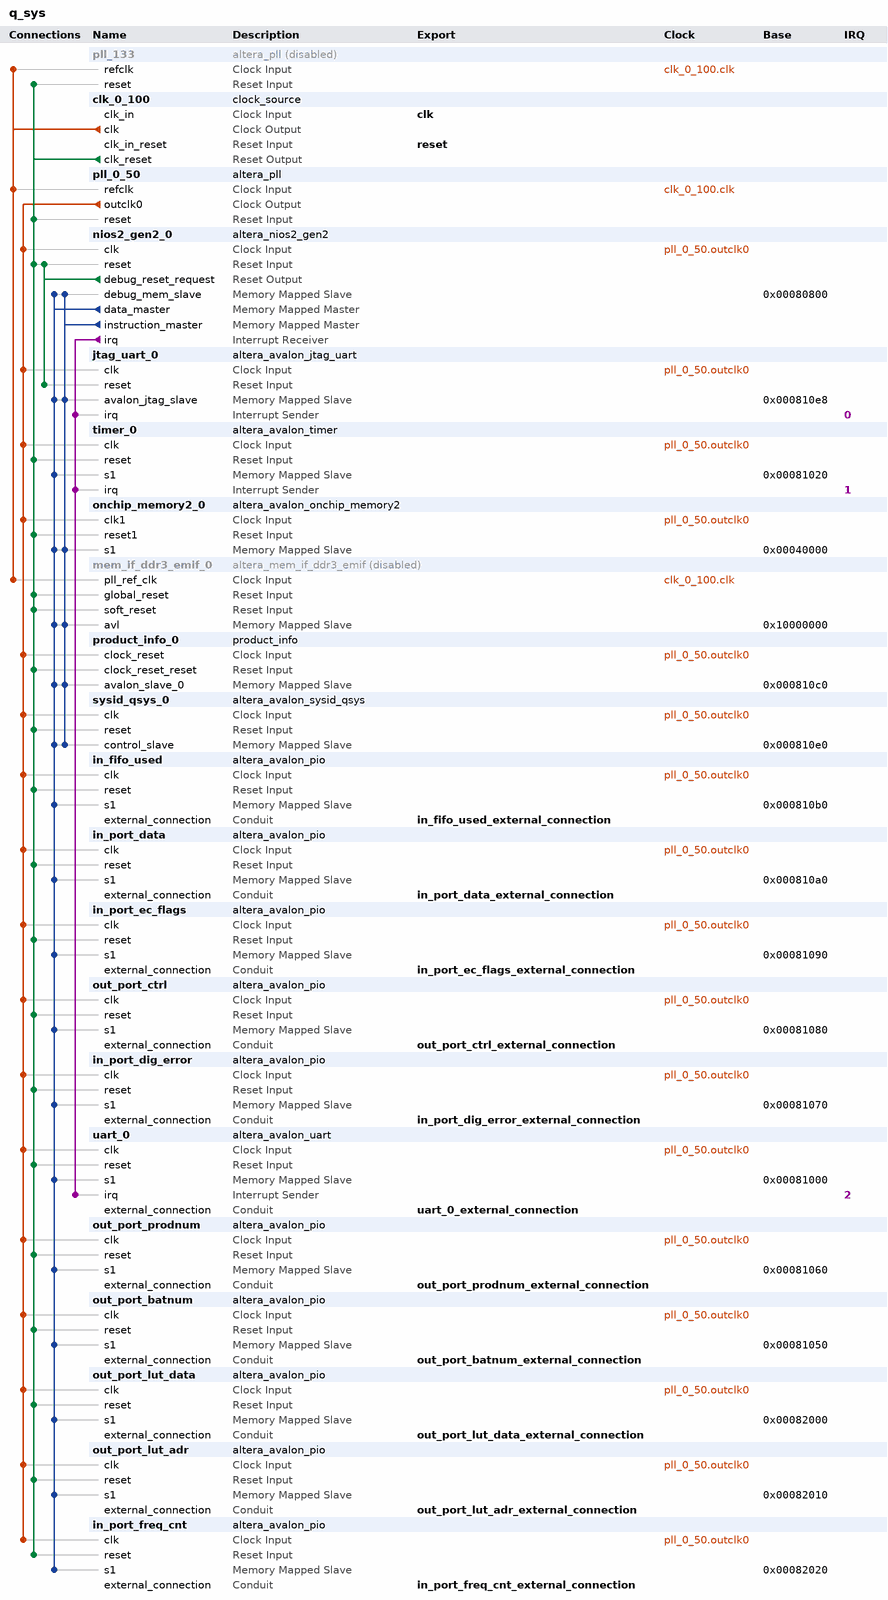
[diagram p0: system contents]
# Platform Designer (Qsys) system q_sys, Arria V 5AGXFB3H4F35C5
# Parameters at their usual value, and those the tool derives, are not listed.
package require -exact qsys 18.1
create_system q_sys
set_project_property DEVICE_FAMILY {Arria V}
set_project_property DEVICE 5AGXFB3H4F35C5

add_instance pll_133 altera_pll 18.1
set_instance_property pll_133 ENABLED false
set_instance_parameter_value pll_133 gui_device_speed_grade 1
set_instance_parameter_value pll_133 gui_number_of_clocks 1
set_instance_parameter_value pll_133 gui_operation_mode direct
set_instance_parameter_value pll_133 gui_output_clock_frequency0 133.0
set_instance_parameter_value pll_133 gui_pll_mode {Integer-N PLL}
set_instance_parameter_value pll_133 gui_reference_clock_frequency 100.0
set_instance_parameter_value pll_133 gui_use_locked true

add_instance clk_0_100 clock_source 18.1
set_instance_parameter_value clk_0_100 clockFrequency 100000000

add_instance pll_0_50 altera_pll 18.1
set_instance_parameter_value pll_0_50 gui_device_speed_grade 2
set_instance_parameter_value pll_0_50 gui_fractional_cout 24
set_instance_parameter_value pll_0_50 gui_number_of_clocks 1
set_instance_parameter_value pll_0_50 gui_operation_mode direct
set_instance_parameter_value pll_0_50 gui_output_clock_frequency0 50.0
set_instance_parameter_value pll_0_50 gui_pll_mode {Fractional-N PLL}
set_instance_parameter_value pll_0_50 gui_reference_clock_frequency 100.0
set_instance_parameter_value pll_0_50 gui_use_locked false

add_instance nios2_gen2_0 altera_nios2_gen2 18.1
set_instance_parameter_value nios2_gen2_0 dcache_size 2048
set_instance_parameter_value nios2_gen2_0 exceptionSlave onchip_memory2_0.s1
set_instance_parameter_value nios2_gen2_0 icache_size 4096
set_instance_parameter_value nios2_gen2_0 impl Tiny
set_instance_parameter_value nios2_gen2_0 resetSlave onchip_memory2_0.s1

add_instance jtag_uart_0 altera_avalon_jtag_uart 18.1
set_instance_parameter_value jtag_uart_0 simInteractiveOptions NO_INTERACTIVE_WINDOWS

add_instance timer_0 altera_avalon_timer 18.1
set_instance_parameter_value timer_0 period 1
set_instance_parameter_value timer_0 periodUnits MSEC

add_instance onchip_memory2_0 altera_avalon_onchip_memory2 18.1
set_instance_parameter_value onchip_memory2_0 allowInSystemMemoryContentEditor true
set_instance_parameter_value onchip_memory2_0 dataWidth 32
set_instance_parameter_value onchip_memory2_0 dualPort false
set_instance_parameter_value onchip_memory2_0 initMemContent false
set_instance_parameter_value onchip_memory2_0 initializationFileName onchip_mem.hex
set_instance_parameter_value onchip_memory2_0 instanceID CPU1
set_instance_parameter_value onchip_memory2_0 memorySize 196608
set_instance_parameter_value onchip_memory2_0 slave1Latency 2

add_instance mem_if_ddr3_emif_0 altera_mem_if_ddr3_emif 18.1
set_instance_property mem_if_ddr3_emif_0 ENABLED false
set_instance_parameter_value mem_if_ddr3_emif_0 AVL_DATA_WIDTH_PORT 128,32,32,32,32,32
set_instance_parameter_value mem_if_ddr3_emif_0 AVL_MAX_SIZE 64
set_instance_parameter_value mem_if_ddr3_emif_0 CALIBRATION_MODE Skip
set_instance_parameter_value mem_if_ddr3_emif_0 CPORT_TYPE_PORT Bidirectional,Bidirectional,Bidirectional,Bidirectional,Bidirectional,Bidirectional
set_instance_parameter_value mem_if_ddr3_emif_0 EXPORT_AFI_HALF_CLK false
set_instance_parameter_value mem_if_ddr3_emif_0 HARD_EMIF false
set_instance_parameter_value mem_if_ddr3_emif_0 MEM_BANKADDR_WIDTH 3
set_instance_parameter_value mem_if_ddr3_emif_0 MEM_CLK_FREQ 400.0
set_instance_parameter_value mem_if_ddr3_emif_0 MEM_CLK_FREQ_MAX 400.0
set_instance_parameter_value mem_if_ddr3_emif_0 MEM_COL_ADDR_WIDTH 10
set_instance_parameter_value mem_if_ddr3_emif_0 MEM_DQ_WIDTH 32
set_instance_parameter_value mem_if_ddr3_emif_0 MEM_DRV_STR RZQ/6
set_instance_parameter_value mem_if_ddr3_emif_0 MEM_FORMAT DISCRETE
set_instance_parameter_value mem_if_ddr3_emif_0 MEM_ROW_ADDR_WIDTH 13
set_instance_parameter_value mem_if_ddr3_emif_0 MEM_RTT_NOM RZQ/4
set_instance_parameter_value mem_if_ddr3_emif_0 MEM_TCL 9
set_instance_parameter_value mem_if_ddr3_emif_0 MEM_TFAW_NS 45.0
set_instance_parameter_value mem_if_ddr3_emif_0 MEM_TRAS_NS 36.0
set_instance_parameter_value mem_if_ddr3_emif_0 MEM_TRCD_NS 13.5
set_instance_parameter_value mem_if_ddr3_emif_0 MEM_TRFC_NS 110.0
set_instance_parameter_value mem_if_ddr3_emif_0 MEM_TRP_NS 13.5
set_instance_parameter_value mem_if_ddr3_emif_0 MEM_TRRD_NS 7.5
set_instance_parameter_value mem_if_ddr3_emif_0 MEM_TRTP_NS 7.5
set_instance_parameter_value mem_if_ddr3_emif_0 MEM_TWTR 5
set_instance_parameter_value mem_if_ddr3_emif_0 MEM_VENDOR Micron
set_instance_parameter_value mem_if_ddr3_emif_0 MEM_WTCL 7
set_instance_parameter_value mem_if_ddr3_emif_0 PLL_LOCATION Top_Bottom
set_instance_parameter_value mem_if_ddr3_emif_0 POWER_OF_TWO_BUS true
set_instance_parameter_value mem_if_ddr3_emif_0 PRIORITY_PORT 1,1,1,1,1,1
set_instance_parameter_value mem_if_ddr3_emif_0 RATE Quarter
set_instance_parameter_value mem_if_ddr3_emif_0 REF_CLK_FREQ 100.0
set_instance_parameter_value mem_if_ddr3_emif_0 SPEED_GRADE 4
set_instance_parameter_value mem_if_ddr3_emif_0 TIMING_BOARD_AC_SKEW 0.0039
set_instance_parameter_value mem_if_ddr3_emif_0 TIMING_BOARD_AC_TO_CK_SKEW -0.001
set_instance_parameter_value mem_if_ddr3_emif_0 TIMING_BOARD_DERATE_METHOD SLEW_RATE
set_instance_parameter_value mem_if_ddr3_emif_0 TIMING_BOARD_DQ_TO_DQS_SKEW -0.004
set_instance_parameter_value mem_if_ddr3_emif_0 TIMING_BOARD_MAX_CK_DELAY 0.42
set_instance_parameter_value mem_if_ddr3_emif_0 TIMING_BOARD_MAX_DQS_DELAY 0.437
set_instance_parameter_value mem_if_ddr3_emif_0 TIMING_BOARD_SKEW_BETWEEN_DQS 0.029
set_instance_parameter_value mem_if_ddr3_emif_0 TIMING_BOARD_SKEW_CKDQS_DIMM_MAX 0.012
set_instance_parameter_value mem_if_ddr3_emif_0 TIMING_BOARD_SKEW_CKDQS_DIMM_MIN -0.0039
set_instance_parameter_value mem_if_ddr3_emif_0 TIMING_BOARD_SKEW_WITHIN_DQS 0.011
set_instance_parameter_value mem_if_ddr3_emif_0 TIMING_TDH 65
set_instance_parameter_value mem_if_ddr3_emif_0 TIMING_TDQSCK 255
set_instance_parameter_value mem_if_ddr3_emif_0 TIMING_TDQSQ 125
set_instance_parameter_value mem_if_ddr3_emif_0 TIMING_TDQSS 0.25
set_instance_parameter_value mem_if_ddr3_emif_0 TIMING_TDS 30
set_instance_parameter_value mem_if_ddr3_emif_0 TIMING_TDSH 0.2
set_instance_parameter_value mem_if_ddr3_emif_0 TIMING_TDSS 0.2
set_instance_parameter_value mem_if_ddr3_emif_0 TIMING_TIH 140
set_instance_parameter_value mem_if_ddr3_emif_0 TIMING_TIS 190
set_instance_parameter_value mem_if_ddr3_emif_0 TIMING_TQSH 0.4
set_instance_parameter_value mem_if_ddr3_emif_0 USER_DEBUG_LEVEL 1

add_instance product_info_0 product_info 1.0

add_instance sysid_qsys_0 altera_avalon_sysid_qsys 18.1
set_instance_parameter_value sysid_qsys_0 id 1

add_instance in_fifo_used altera_avalon_pio 18.1
set_instance_parameter_value in_fifo_used direction Input
set_instance_parameter_value in_fifo_used width 10

add_instance in_port_data altera_avalon_pio 18.1
set_instance_parameter_value in_port_data direction Input
set_instance_parameter_value in_port_data width 32

add_instance in_port_ec_flags altera_avalon_pio 18.1
set_instance_parameter_value in_port_ec_flags direction Input
set_instance_parameter_value in_port_ec_flags width 3

add_instance out_port_ctrl altera_avalon_pio 18.1
set_instance_parameter_value out_port_ctrl direction Output
set_instance_parameter_value out_port_ctrl width 8

add_instance in_port_dig_error altera_avalon_pio 18.1
set_instance_parameter_value in_port_dig_error direction Input
set_instance_parameter_value in_port_dig_error width 20

add_instance uart_0 altera_avalon_uart 18.1
set_instance_parameter_value uart_0 baud 115200
set_instance_parameter_value uart_0 dataBits 8
set_instance_parameter_value uart_0 fixedBaud true
set_instance_parameter_value uart_0 parity NONE
set_instance_parameter_value uart_0 stopBits 1

add_instance out_port_prodnum altera_avalon_pio 18.1
set_instance_parameter_value out_port_prodnum direction Output
set_instance_parameter_value out_port_prodnum width 10

add_instance out_port_batnum altera_avalon_pio 18.1
set_instance_parameter_value out_port_batnum direction Output
set_instance_parameter_value out_port_batnum width 10

add_instance out_port_lut_data altera_avalon_pio 18.1
set_instance_parameter_value out_port_lut_data direction Output
set_instance_parameter_value out_port_lut_data width 32

add_instance out_port_lut_adr altera_avalon_pio 18.1
set_instance_parameter_value out_port_lut_adr direction Output
set_instance_parameter_value out_port_lut_adr width 11

add_instance in_port_freq_cnt altera_avalon_pio 18.1
set_instance_parameter_value in_port_freq_cnt direction Input
set_instance_parameter_value in_port_freq_cnt width 16

# connections
add_connection clk_0_100.clk mem_if_ddr3_emif_0.pll_ref_clk clock
add_connection clk_0_100.clk pll_0_50.refclk clock
add_connection clk_0_100.clk pll_133.refclk clock
add_connection pll_0_50.outclk0 in_fifo_used.clk clock
add_connection pll_0_50.outclk0 in_port_data.clk clock
add_connection pll_0_50.outclk0 in_port_dig_error.clk clock
add_connection pll_0_50.outclk0 in_port_ec_flags.clk clock
add_connection pll_0_50.outclk0 in_port_freq_cnt.clk clock
add_connection pll_0_50.outclk0 jtag_uart_0.clk clock
add_connection pll_0_50.outclk0 nios2_gen2_0.clk clock
add_connection pll_0_50.outclk0 onchip_memory2_0.clk1 clock
add_connection pll_0_50.outclk0 out_port_batnum.clk clock
add_connection pll_0_50.outclk0 out_port_ctrl.clk clock
add_connection pll_0_50.outclk0 out_port_lut_adr.clk clock
add_connection pll_0_50.outclk0 out_port_lut_data.clk clock
add_connection pll_0_50.outclk0 out_port_prodnum.clk clock
add_connection pll_0_50.outclk0 product_info_0.clock_reset clock
add_connection pll_0_50.outclk0 sysid_qsys_0.clk clock
add_connection pll_0_50.outclk0 timer_0.clk clock
add_connection pll_0_50.outclk0 uart_0.clk clock
add_connection clk_0_100.clk_reset in_fifo_used.reset reset
add_connection clk_0_100.clk_reset in_port_data.reset reset
add_connection clk_0_100.clk_reset in_port_dig_error.reset reset
add_connection clk_0_100.clk_reset in_port_ec_flags.reset reset
add_connection clk_0_100.clk_reset in_port_freq_cnt.reset reset
add_connection clk_0_100.clk_reset mem_if_ddr3_emif_0.global_reset reset
add_connection clk_0_100.clk_reset mem_if_ddr3_emif_0.soft_reset reset
add_connection clk_0_100.clk_reset nios2_gen2_0.reset reset
add_connection clk_0_100.clk_reset onchip_memory2_0.reset1 reset
add_connection clk_0_100.clk_reset out_port_batnum.reset reset
add_connection clk_0_100.clk_reset out_port_ctrl.reset reset
add_connection clk_0_100.clk_reset out_port_lut_adr.reset reset
add_connection clk_0_100.clk_reset out_port_lut_data.reset reset
add_connection clk_0_100.clk_reset out_port_prodnum.reset reset
add_connection clk_0_100.clk_reset pll_0_50.reset reset
add_connection clk_0_100.clk_reset pll_133.reset reset
add_connection clk_0_100.clk_reset product_info_0.clock_reset_reset reset
add_connection clk_0_100.clk_reset sysid_qsys_0.reset reset
add_connection clk_0_100.clk_reset timer_0.reset reset
add_connection clk_0_100.clk_reset uart_0.reset reset
add_connection nios2_gen2_0.debug_reset_request jtag_uart_0.reset reset
add_connection nios2_gen2_0.debug_reset_request nios2_gen2_0.reset reset
add_connection nios2_gen2_0.data_master in_fifo_used.s1 avalon
set_connection_parameter_value nios2_gen2_0.data_master/in_fifo_used.s1 baseAddress 0x000810b0
add_connection nios2_gen2_0.data_master in_port_data.s1 avalon
set_connection_parameter_value nios2_gen2_0.data_master/in_port_data.s1 baseAddress 0x000810a0
add_connection nios2_gen2_0.data_master in_port_dig_error.s1 avalon
set_connection_parameter_value nios2_gen2_0.data_master/in_port_dig_error.s1 baseAddress 0x00081070
add_connection nios2_gen2_0.data_master in_port_ec_flags.s1 avalon
set_connection_parameter_value nios2_gen2_0.data_master/in_port_ec_flags.s1 baseAddress 0x00081090
add_connection nios2_gen2_0.data_master in_port_freq_cnt.s1 avalon
set_connection_parameter_value nios2_gen2_0.data_master/in_port_freq_cnt.s1 baseAddress 0x00082020
add_connection nios2_gen2_0.data_master jtag_uart_0.avalon_jtag_slave avalon
set_connection_parameter_value nios2_gen2_0.data_master/jtag_uart_0.avalon_jtag_slave baseAddress 0x000810e8
add_connection nios2_gen2_0.data_master mem_if_ddr3_emif_0.avl avalon
set_connection_parameter_value nios2_gen2_0.data_master/mem_if_ddr3_emif_0.avl baseAddress 0x10000000
add_connection nios2_gen2_0.data_master nios2_gen2_0.debug_mem_slave avalon
set_connection_parameter_value nios2_gen2_0.data_master/nios2_gen2_0.debug_mem_slave baseAddress 0x00080800
add_connection nios2_gen2_0.data_master onchip_memory2_0.s1 avalon
set_connection_parameter_value nios2_gen2_0.data_master/onchip_memory2_0.s1 baseAddress 0x00040000
add_connection nios2_gen2_0.data_master out_port_batnum.s1 avalon
set_connection_parameter_value nios2_gen2_0.data_master/out_port_batnum.s1 baseAddress 0x00081050
add_connection nios2_gen2_0.data_master out_port_ctrl.s1 avalon
set_connection_parameter_value nios2_gen2_0.data_master/out_port_ctrl.s1 baseAddress 0x00081080
add_connection nios2_gen2_0.data_master out_port_lut_adr.s1 avalon
set_connection_parameter_value nios2_gen2_0.data_master/out_port_lut_adr.s1 baseAddress 0x00082010
add_connection nios2_gen2_0.data_master out_port_lut_data.s1 avalon
set_connection_parameter_value nios2_gen2_0.data_master/out_port_lut_data.s1 baseAddress 0x00082000
add_connection nios2_gen2_0.data_master out_port_prodnum.s1 avalon
set_connection_parameter_value nios2_gen2_0.data_master/out_port_prodnum.s1 baseAddress 0x00081060
add_connection nios2_gen2_0.data_master product_info_0.avalon_slave_0 avalon
set_connection_parameter_value nios2_gen2_0.data_master/product_info_0.avalon_slave_0 baseAddress 0x000810c0
add_connection nios2_gen2_0.data_master sysid_qsys_0.control_slave avalon
set_connection_parameter_value nios2_gen2_0.data_master/sysid_qsys_0.control_slave baseAddress 0x000810e0
add_connection nios2_gen2_0.data_master timer_0.s1 avalon
set_connection_parameter_value nios2_gen2_0.data_master/timer_0.s1 baseAddress 0x00081020
add_connection nios2_gen2_0.data_master uart_0.s1 avalon
set_connection_parameter_value nios2_gen2_0.data_master/uart_0.s1 baseAddress 0x00081000
add_connection nios2_gen2_0.instruction_master jtag_uart_0.avalon_jtag_slave avalon
set_connection_parameter_value nios2_gen2_0.instruction_master/jtag_uart_0.avalon_jtag_slave baseAddress 0x000810e8
add_connection nios2_gen2_0.instruction_master mem_if_ddr3_emif_0.avl avalon
set_connection_parameter_value nios2_gen2_0.instruction_master/mem_if_ddr3_emif_0.avl baseAddress 0x10000000
add_connection nios2_gen2_0.instruction_master nios2_gen2_0.debug_mem_slave avalon
set_connection_parameter_value nios2_gen2_0.instruction_master/nios2_gen2_0.debug_mem_slave baseAddress 0x00080800
add_connection nios2_gen2_0.instruction_master onchip_memory2_0.s1 avalon
set_connection_parameter_value nios2_gen2_0.instruction_master/onchip_memory2_0.s1 baseAddress 0x00040000
add_connection nios2_gen2_0.instruction_master product_info_0.avalon_slave_0 avalon
set_connection_parameter_value nios2_gen2_0.instruction_master/product_info_0.avalon_slave_0 baseAddress 0x000810c0
add_connection nios2_gen2_0.instruction_master sysid_qsys_0.control_slave avalon
set_connection_parameter_value nios2_gen2_0.instruction_master/sysid_qsys_0.control_slave baseAddress 0x000810e0
add_connection nios2_gen2_0.irq jtag_uart_0.irq interrupt
set_connection_parameter_value nios2_gen2_0.irq/jtag_uart_0.irq irqNumber 0
add_connection nios2_gen2_0.irq timer_0.irq interrupt
set_connection_parameter_value nios2_gen2_0.irq/timer_0.irq irqNumber 1
add_connection nios2_gen2_0.irq uart_0.irq interrupt
set_connection_parameter_value nios2_gen2_0.irq/uart_0.irq irqNumber 2

# exported interfaces
add_interface clk clock sink
set_interface_property clk EXPORT_OF clk_0_100.clk_in
add_interface in_fifo_used_external_connection conduit end
set_interface_property in_fifo_used_external_connection EXPORT_OF in_fifo_used.external_connection
add_interface in_port_data_external_connection conduit end
set_interface_property in_port_data_external_connection EXPORT_OF in_port_data.external_connection
add_interface in_port_dig_error_external_connection conduit end
set_interface_property in_port_dig_error_external_connection EXPORT_OF in_port_dig_error.external_connection
add_interface in_port_ec_flags_external_connection conduit end
set_interface_property in_port_ec_flags_external_connection EXPORT_OF in_port_ec_flags.external_connection
add_interface in_port_freq_cnt_external_connection conduit end
set_interface_property in_port_freq_cnt_external_connection EXPORT_OF in_port_freq_cnt.external_connection
add_interface out_port_batnum_external_connection conduit end
set_interface_property out_port_batnum_external_connection EXPORT_OF out_port_batnum.external_connection
add_interface out_port_ctrl_external_connection conduit end
set_interface_property out_port_ctrl_external_connection EXPORT_OF out_port_ctrl.external_connection
add_interface out_port_lut_adr_external_connection conduit end
set_interface_property out_port_lut_adr_external_connection EXPORT_OF out_port_lut_adr.external_connection
add_interface out_port_lut_data_external_connection conduit end
set_interface_property out_port_lut_data_external_connection EXPORT_OF out_port_lut_data.external_connection
add_interface out_port_prodnum_external_connection conduit end
set_interface_property out_port_prodnum_external_connection EXPORT_OF out_port_prodnum.external_connection
add_interface reset reset sink
set_interface_property reset EXPORT_OF clk_0_100.clk_in_reset
add_interface uart_0_external_connection conduit end
set_interface_property uart_0_external_connection EXPORT_OF uart_0.external_connection

set_interconnect_requirement {$system} qsys_mm.clockCrossingAdapter AUTO
set_interconnect_requirement {$system} qsys_mm.maxAdditionalLatency 4

save_system q_sys.qsys
